# EAGLE design PiInTheSky-Mainboard-v2.3 (EAGLE 6.4)
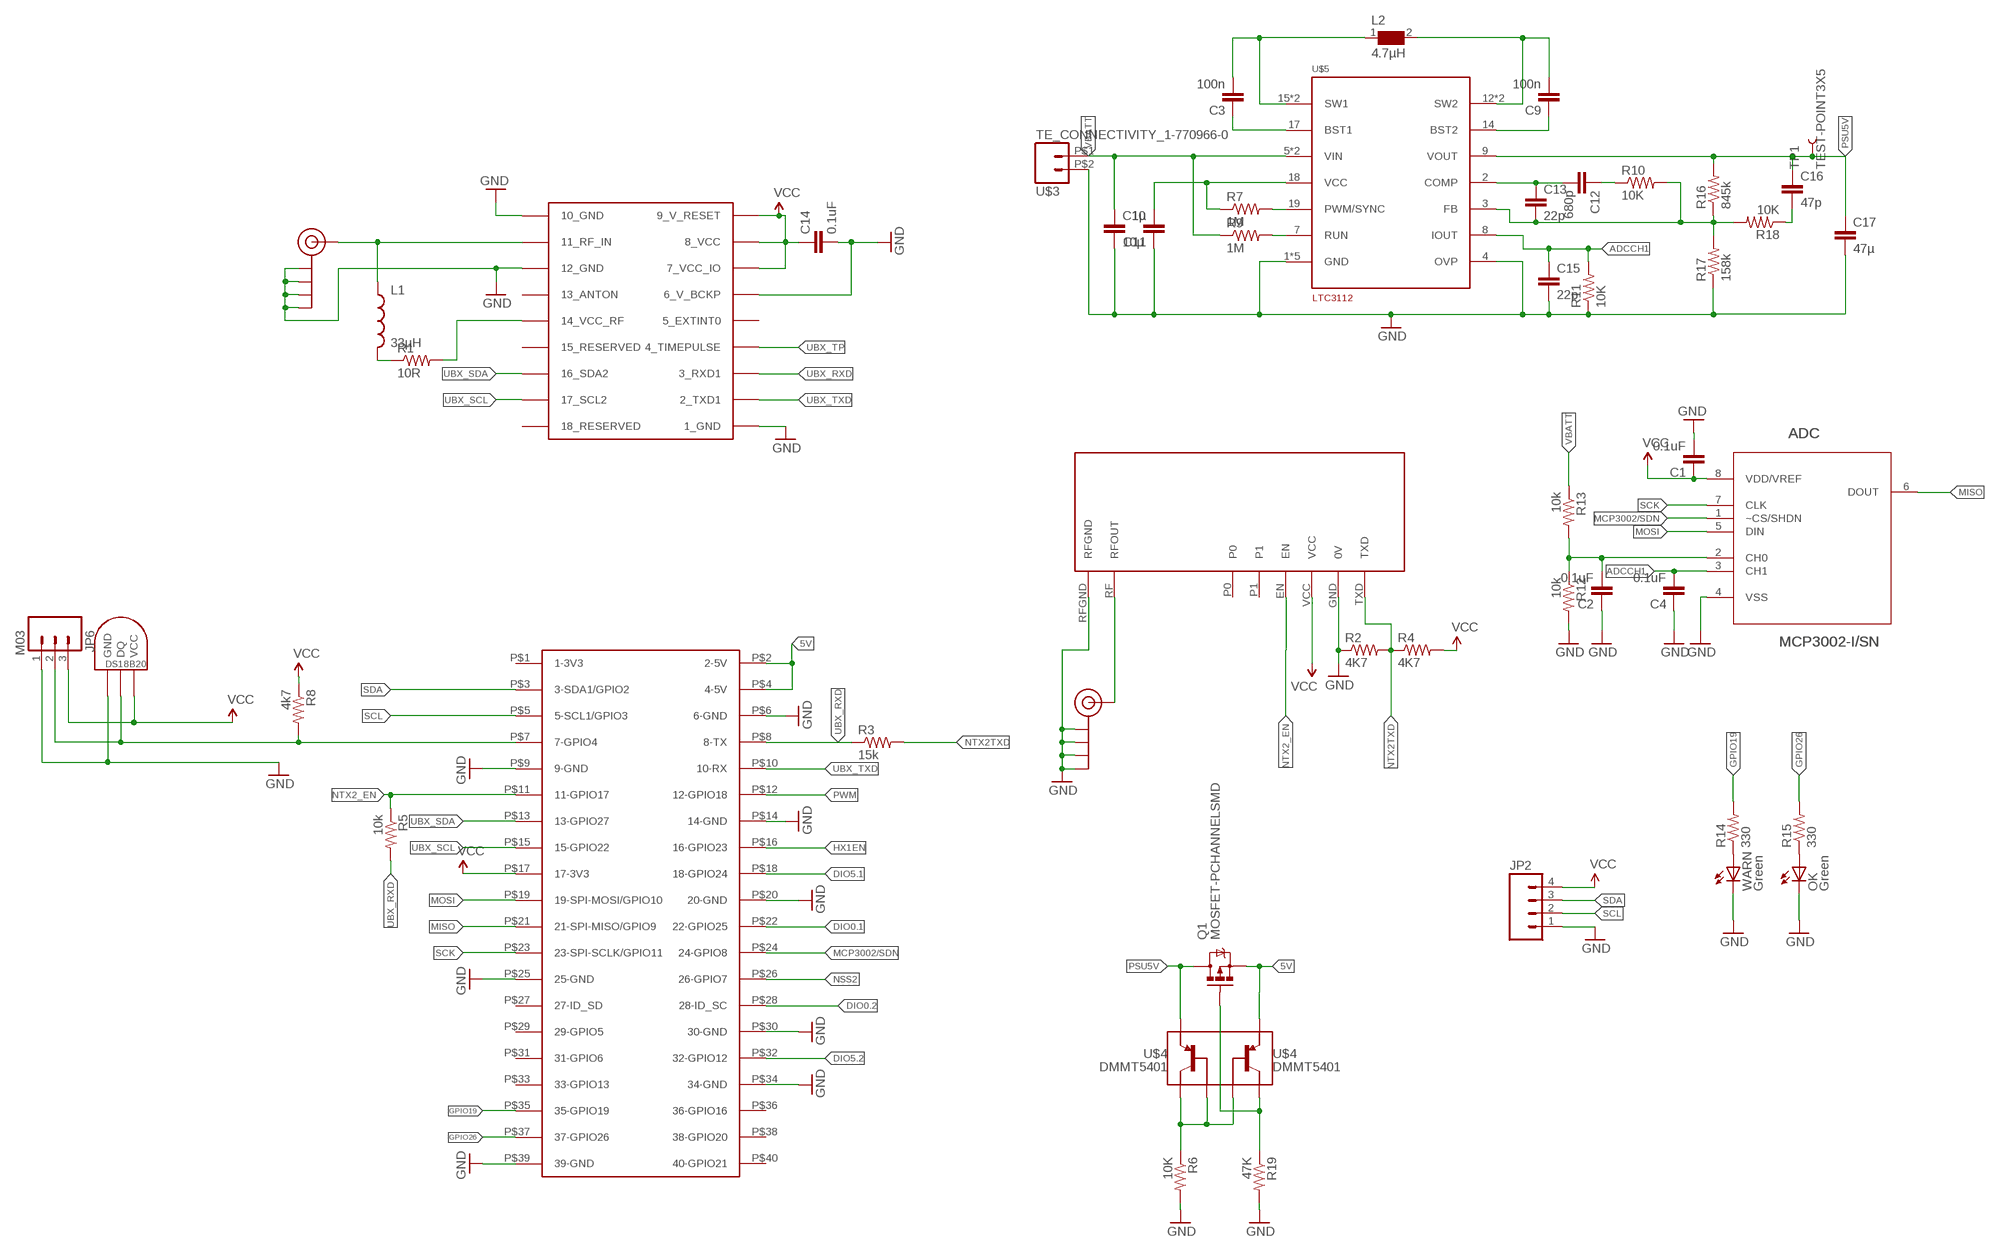
[diagram p0: schematic, sheet 1]

## Parts
ADC  MCP3002-I/SN  [SOIC127P600X175-8N]
C1  0.1uF  CAP0603-CAP  [0603-CAP]
C2  0.1uF  CAP0603-CAP  [0603-CAP]
C3  100n  CAP0603-CAP  [0603-CAP]
C4  0.1uF  CAP0603-CAP  [0603-CAP]
C9  100n  CAP0603-CAP  [0603-CAP]
C10  10µ  CAP1206  [1206]
C11  1µ  CAP0603-CAP  [0603-CAP]
C12  680p  CAP0603-CAP  [0603-CAP]
C13  22p  CAP0603-CAP  [0603-CAP]
C14  0.1uF  CAP0603-CAP  [0603-CAP]
C15  22p  CAP0603-CAP  [0603-CAP]
C16  47p  CAP0603-CAP  [0603-CAP]
C17  47µ  CAP1206  [1206]
J$1  SMA_EDGE  [SMA-EDGE]
J$2  SMA_EDGE  [SMA-EDGE]
JP2  M04PTH  [1X04]
JP6  M03  [M03-JST]
L1  33µH  INDUCTOR0603  [0603]
L2  4.7µH  WE-HCI-744311470_7030/7040/7050  [WE-HCI_7030/7040/7050]
OK  Green  LED0603  [LED-0603]
Q1  MOSFET-PCHANNELSMD  [SOT23-3]
R1  10R  RESISTOR0603-RES  [0603-RES]
R2  4K7  RESISTOR0603-RES  [0603-RES]
R3  15k  RESISTOR0603-RES  [0603-RES]
R4  4K7  RESISTOR0603-RES  [0603-RES]
R5  10k  RESISTOR0603-RES  [0603-RES]
R6  10K  RESISTOR0603-RES  [0603-RES]
R7  1M  RESISTOR0603-RES  [0603-RES]
R8  4k7  RESISTOR0603-RES  [0603-RES]
R9  1M  RESISTOR0603-RES  [0603-RES]
R10  10K  RESISTOR0603-RES  [0603-RES]
R11  10K  RESISTOR0603-RES  [0603-RES]
R12  10k  RESISTOR0603-RES  [0603-RES]
R13  10k  RESISTOR0603-RES  [0603-RES]
R14  330  RESISTOR0603-RES  [0603-RES]
R15  330  RESISTOR0603-RES  [0603-RES]
R16  845k  RESISTOR0603-RES  [0603-RES]
R17  158k  RESISTOR0603-RES  [0603-RES]
R18  10K  RESISTOR0603-RES  [0603-RES]
R19  47K  RESISTOR0603-RES  [0603-RES]
TEMP  DS1821  DS1820SOIC  [DS18B20_SOIC]
TP1  TEST-POINT3X5  [PAD.03X.05]
U$1  RASPBERRY-PI+  [RASPBERRY-PI-PLUS-CAM_NOTCH]
U$3  TE_CONNECTIVITY_1-770966-0  [TE_CONNECTIVITY_1-770966-0]
U$4  DMMT5401  [SOT26]
U$5  LTC3112  [TSSOP-20]
U$7  UBLOX_MAX  [UBLOX_MAX]
U$8  RADIOMETRIX-MTX2  [RADIOMETRIX-MTX2]
WARN  Green  LED0603  [LED-0603]

## Nets
5V: Q1.2(S) U$1.P$2(2-5V) U$1.P$4(4-5V) U$4.5(E2)
ADCCH1: ADC.3(CH1) C4.2 C15.1 R11.2 U$5.8(IOUT)
DIO0.1: U$1.P$22(22-GPIO25)
DIO0.2: U$1.P$28(28-ID_SC)
DIO5.1: U$1.P$18(18-GPIO24)
DIO5.2: U$1.P$32(32-GPIO12)
GND [vcc]: ADC.4(VSS) C1.2 C2.1 C4.1 C10.2 C11.1 C14.2 C15.2 C17.2 J$1.GND@0(GND) J$1.GND@1(GND) J$1.GND@2(GND) J$1.GND@3(GND) J$2.GND@0(GND) J$2.GND@1(GND) J$2.GND@2(GND) J$2.GND@3(GND) JP2.1 JP6.1 OK.C R2.1 R6.2 R11.1 R12.2 R17.1 R19.2 TEMP.GND U$1.P$6(6-GND) U$1.P$9(9-GND) U$1.P$14(14-GND) U$1.P$20(20-GND) U$1.P$25(25-GND) U$1.P$30(30-GND) U$1.P$34(34-GND) U$1.P$39(39-GND) U$3.P$2 U$5.1(GND) U$5.4(OVP) U$5.10(GND) U$5.11(GND) U$5.20(GND) U$5.21(GND) U$7.1_GND U$7.6_V_BCKP U$7.10_GND U$7.12_GND U$8.GND(0V) U$8.RFGND WARN.C
GPIO1: JP6.2 R8.2 TEMP.DQ U$1.P$7(7-GPIO4)
GPIO19: R14.2 U$1.P$35(35-GPIO19)
GPIO26: R15.2 U$1.P$37(37-GPIO26)
HX1EN: U$1.P$16(16-GPIO23)
MCP3002/SDN: ADC.1(~CS/SHDN) U$1.P$24(24-GPIO8)
MISO: ADC.6(DOUT) U$1.P$21(21-SPI-MISO/GPIO9)
MOSI: ADC.5(DIN) U$1.P$19(19-SPI-MOSI/GPIO10)
N$1: J$1.SIG(SIGNAL) L1.1 U$7.11_RF_IN
N$2: R1.2 U$7.14_VCC_RF
N$3: L1.2 R1.1
N$4: J$2.SIG(SIGNAL) U$8.RF(RFOUT)
N$5: C3.1 U$5.17(BST1)
N$6: ADC.2(CH0) C2.2 R12.1 R13.2
N$9: R6.1 U$4.1(C1) U$4.2(B1) U$4.3(B2)
N$10: C9.1 U$5.14(BST2)
N$11: C9.2 L2.2 U$5.12(SW2) U$5.13(SW2)
N$12: OK.A R15.1
N$13: C3.2 L2.1 U$5.15(SW1) U$5.16(SW1)
N$14: C11.2 R7.1 U$5.18(VCC)
N$16: R9.2 U$5.7(RUN)
N$17: R14.1 WARN.A
N$18: R7.2 U$5.19(PWM/SYNC)
N$19: C13.2 R10.2 R16.1 R17.2 R18.2 U$5.3(FB)
N$20: C12.2 C13.1 U$5.2(COMP)
N$21: C12.1 R10.1
N$22: C16.2 R18.1
N$24: Q1.1(G) R19.1 U$4.4(C2)
NSS2: U$1.P$26(26-GPIO7)
NTX2_EN: R5.1 U$1.P$11(11-GPIO17) U$8.EN
NTX2TXD: R2.2 R3.2 R4.1 U$8.TXD
PSU5V: C16.1 C17.1 Q1.3(D) R16.2 TP1.P$1 U$4.6(E1) U$5.9(VOUT)
PWM: U$1.P$12(12-GPIO18)
SCK: ADC.7(CLK) U$1.P$23(23-SPI-SCLK/GPIO11)
SCL: JP2.2 U$1.P$5(5-SCL1/GPIO3)
SDA: JP2.3 U$1.P$3(3-SDA1/GPIO2)
UBX_RXD: R3.1 R5.2 U$1.P$8(8-TX) U$7.3_RXD1
UBX_SCL: U$1.P$15(15-GPIO22) U$7.17_SCL2
UBX_SDA: U$1.P$13(13-GPIO27) U$7.16_SDA2
UBX_TP: U$7.4_TIMEPULSE
UBX_TXD: U$1.P$10(10-RX) U$7.2_TXD1
VBATT [vcc]: C10.1 R9.1 R13.1 U$3.P$1 U$5.5(VIN) U$5.6(VIN)
VCC: ADC.8(VDD/VREF) C1.1 C14.1 JP2.4 JP6.3 R4.2 R8.1 TEMP.VCC U$1.P$17(17-3V3) U$7.7_VCC_IO U$7.8_VCC U$7.9_V_RESET U$8.VCC
Unconnected: U$1.P$1(1-3V3) U$1.P$27(27-ID_SD) U$1.P$29(29-GPIO5) U$1.P$31(31-GPIO6) U$1.P$33(33-GPIO13) U$1.P$36(36-GPIO16) U$1.P$38(38-GPIO20) U$1.P$40(40-GPIO21) U$7.5_EXTINT0 U$7.13_ANTON U$7.15_RESERVED U$7.18_RESERVED U$8.P0 U$8.P1

## Library data of the parts
ADC = Ava:MCP3002-I/SN: Dual Channel 10-Bit A/D Converter; DESCRIPTION: Dual Channel 10-Bit A/D Converter; MPN: MCP3002-I/SN; OC_FARNELL: 1834969; OC_NEWARK: 59K0225; PACKAGE: SOIC-8; SUPPLIER: Microchip
C1-C4 C9-C17 = SparkFun:CAP: Capacitor Standard 0603 ceramic capacitor, and 0.1" leaded capacitor.
J$1 J$2 = SparkFun:SMA_EDGE: SMA Antenna Connector End launch SMA connector. The paste layer has been removed so that the connector can be hand soldered onto the board after reflow.
JP2 = SparkFun:M04: Header 4 Standard 4-pin 0.1" header. Use with straight break away headers (SKU : PRT-00116), right angle break away headers (PRT-00553), swiss pins (PRT-00743), machine pins (PRT-00117), and female headers (PRT-00115). Molex polarized connector foot print use with SKU : PRT-08231 with associated crimp pins and housings. 1MM SMD Version SKU: PRT-10208
JP6 = Ava:M03
L1 = SparkFun:INDUCTOR: Inductors Basic Inductor/Choke - 0603 and 1206. Footprints are not proven and vary greatly between part numbers.
L2 = WE-HCI:WE-HCI: SMD-Flat Wire High Current Inductor WE-HCI - Flat wire coil for lower losses at high frequency ranges - Low leakage field - Extremely low profile design - Current loading up to 40 A - Magnetically shielded -- Graphic cards -- Laptops -- Motherboards -- High current switching regulators -- Polyphase-switching regulators -- industrial computers; MPN: 744311470; OC_FARNELL: 1636195; OC_NEWARK: 08P2569; PACKAGE: 7040; SUPPLIER: Würth Elektronik eiSos GmbH
OK WARN = SparkFun:LED: LEDs Standard schematic elements and footprints for 5mm, 3mm, 1206, and 0603 sized LEDs. 5mm - Spark Fun Electronics SKU : COM-00529 (and others)
Q1 = SparkFun:MOSFET-PCHANNEL
R1-R19 = SparkFun:RESISTOR: Resistor Basic schematic elements and footprints for 0603, 1206, and PTH resistors.
TEMP = Ava:DS1820: DS18B20 Programmable Resolution 1-Wire Digital Thermometer Description The DS18B20 digital thermometer provides 9-bit to 12-bit Celsius temperature measurements and has an alarm function with nonvolatile user-programmable upper and lower trigger points. The DS18B20 communicates over a 1-Wire® bus that by definition requires only one data line (and ground) for communication with a central microprocessor. It has an operating temperature range of -55°C to +125°C and is accurate to ±0.5°C over the range of -10°C to +85°C. In addition, the DS18B20 can derive power directly from the data line ("parasite power"), eliminating the need for an external power supply. Each DS18B20 has a unique 64-bit serial code, which allows multiple DS18B20s to function on the same 1-Wire bus. Thus, it is simple to use one microprocessor to control many DS18B20s distributed over a large area. Applications that can benefit from this feature include HVAC environmental controls, temperature monitoring systems inside buildings, equipment, or machinery, and process monitoring and control systems.
TP1 = SparkFun:TEST-POINT
U$1 = Ava:RASPBERRY-PI+: Samtec SSW-120-01-T-D
U$3 = Ava:TE_CONNECTIVITY_1-770966-0; FARNELL: 1098556
U$4 = Ava:DMMT5401
U$5 = Ava:LTC3112
U$7 = Ava:UBLOX_MAX: UBLOX MAX
U$8 = Ava:RADIOMETRIX-MTX2

## Net classes
0 default: width 0.203 mm
1 vcc: width 0.254 mm

## Board
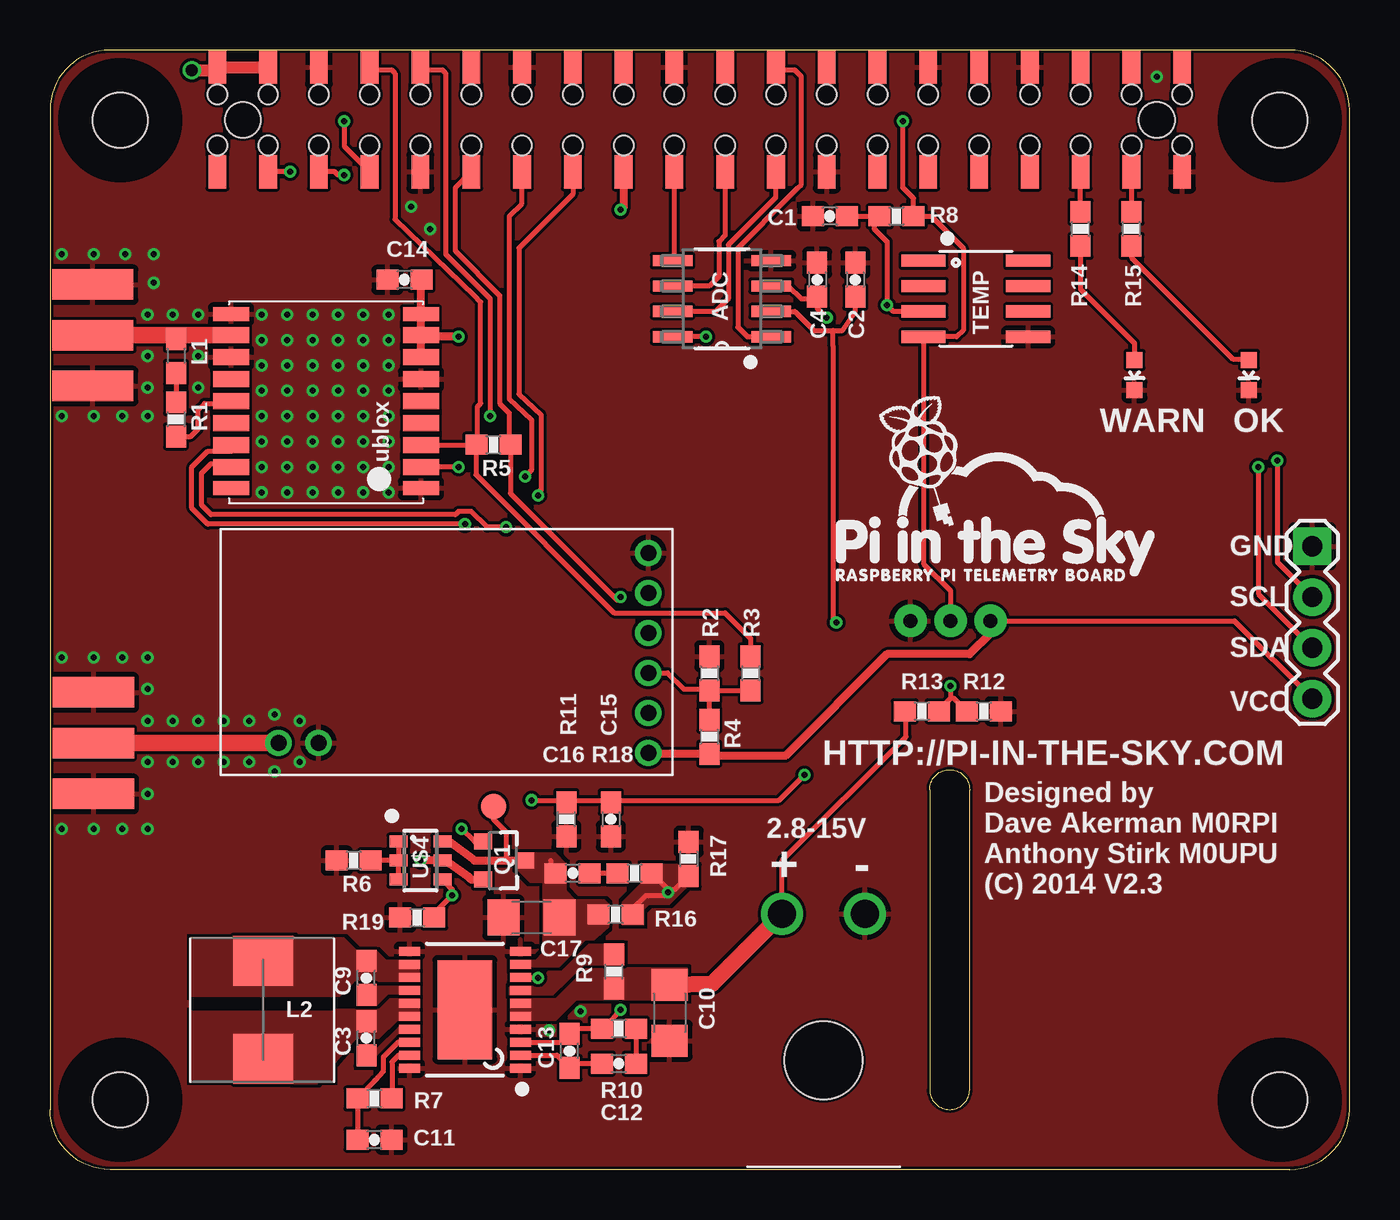
[diagram p1: board, top side]
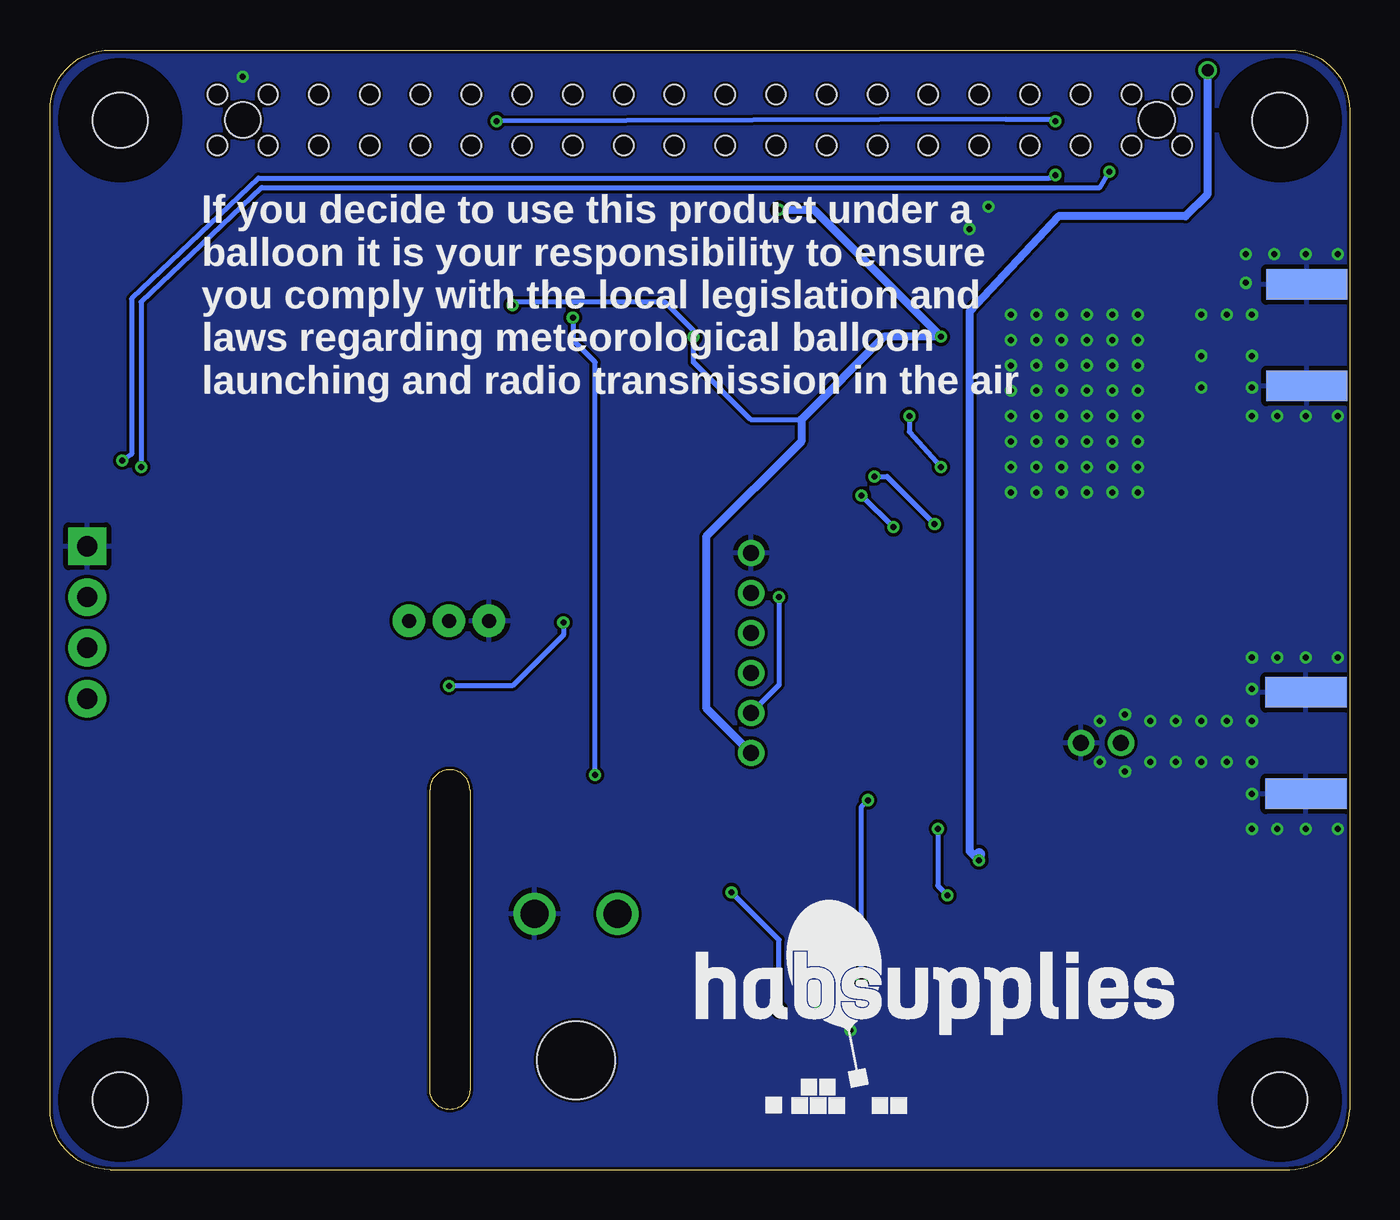
[diagram p2: board, bottom side, seen from below]

Size 65 x 56 mm. Coordinates in mm from the lower left corner, seen from the top.
Copper layers (1*16): Top 0.035mm / dielectric 1.5mm / Bottom 0.035mm
Design rules "Hackvana": minimum track width 0.15mm, minimum drill 0.3mm, track to track 6mil, track to pad 6mil, pad to pad 6mil, via to via 6mil, smd to smd 0mil, copper to edge 6mil, drill to drill 6mil, minimum pad ring 10mil, minimum via ring 6mil, stop-mask expansion 2mil, vias tented up to drill 100mil, thermal gap 10mil
tRestrict: area 7,8 to 14.2,8.6

### Footprints (pad centres in the part's own frame; a part is rotated, then mirrored left to right if it is on the bottom)
SOIC127P600X175-8N = smd 1.981 x 0.559: 1 -2.464,1.905; 2 -2.464,0.635; 3 -2.464,-0.635; 4 -2.464,-1.905; 5 2.464,-1.905; 6 2.464,-0.635; 7 2.464,0.635; 8 2.464,1.905
0603-CAP = smd 1.1 x 1: 1 -0.85,0; 2 0.85,0
1206 = smd 1.6 x 1.8: 1 -1.4,0; 2 1.4,0
SMA-EDGE = smd 1.524 x 4.064: GND@0 -2.54,0; GND@1 2.54,0; SIG 0,0 | smd 1.524 x 4.064 bottom: GND@2 -2.54,0; GND@3 2.54,0
1X04 = drill 1.016 pad 1.88 square: 1 0,0 | drill 1.016 pad 1.88: 2 2.54,0; 3 5.08,0; 4 7.62,0
M03-JST = drill 0.7 pad 1.626: 1 -2,0.08; 2 0,0.08; 3 2,0.08
0603 = smd 1.1 x 1: 1 -0.85,0; 2 0.85,0
WE-HCI_7030/7040/7050 = smd 2.5 x 3: 1 -2.45,0; 2 2.45,0
LED-0603 = smd 0.8 x 0.8: A 0,-0.75; C 0,0.75
SOT23-3 = smd 0.8 x 0.9: 1 -0.95,-1; 2 0.95,-1; 3 0,1.1
0603-RES = smd 1.1 x 1: 1 -0.85,0; 2 0.85,0
DS18B20_SOIC = smd 0.61 x 2.21: DQ 1.905,-2.616; GND 1.905,2.616; NC -1.905,-2.616; NC2 -0.635,-2.616; NC3 -1.905,2.616; NC4 -0.635,2.616; NC5 0.635,2.616; VCC 0.635,-2.616
PAD.03X.05 = smd 1.27 x 1.27: P$1 0,0
RASPBERRY-PI-PLUS-CAM_NOTCH = smd 0.889 x 1.68: P$1 -34.13,21.905; P$2 -34.13,27.145; P$3 -31.59,21.905; P$4 -31.59,27.145; P$5 -29.05,21.905; P$6 -29.05,27.145; P$7 -26.51,21.905; P$8 -26.51,27.145; P$9 -23.97,21.905; P$10 -23.97,27.145; P$11 -21.43,21.905; P$12 -21.43,27.145; P$13 -18.89,21.905; P$14 -18.89,27.145; P$15 -16.35,21.905; P$16 -16.35,27.145; P$17 -13.81,21.905; P$18 -13.81,27.145; P$19 -11.27,21.905; P$20 -11.27,27.145; P$21 -8.73,21.905; P$22 -8.73,27.145; P$23 -6.19,21.905; P$24 -6.19,27.145; P$25 -3.65,21.905; P$26 -3.65,27.145; P$27 -1.11,21.905; P$28 -1.11,27.145; P$29 1.43,21.905; P$30 1.43,27.145; P$31 3.97,21.905; P$32 3.97,27.145; P$33 6.51,21.905; P$34 6.51,27.145; P$35 9.05,21.905; P$36 9.05,27.145; P$37 11.59,21.905; P$38 11.59,27.145; P$39 14.13,21.905; P$40 14.13,27.145 | hole 2.75: -39,24.5; 19,24.5; -39,-24.5; 19,-24.5 | hole 1.78: -32.86,24.5; 12.86,24.5 | hole 0.97: -34.13,25.77; -31.59,25.77; -29.05,25.77; -26.51,25.77; -23.97,25.77; -21.43,25.77; -18.89,25.77; -16.35,25.77; -13.81,25.77; -11.27,25.77; -8.73,25.77; -6.19,25.77; -3.65,25.77; -1.11,25.77; 1.43,25.77; 3.97,25.77; 6.51,25.77; 9.05,25.77; 11.59,25.77; 14.13,25.77; -34.13,23.23; -31.59,23.23; -29.05,23.23; -26.51,23.23; -23.97,23.23; -21.43,23.23; -18.89,23.23; -16.35,23.23; -13.81,23.23; -11.27,23.23; -8.73,23.23; -6.19,23.23; -3.65,23.23; -1.11,23.23; 1.43,23.23; 3.97,23.23; 6.51,23.23; 9.05,23.23; 11.59,23.23; 14.13,23.23
TE_CONNECTIVITY_1-770966-0 = drill 1.4: P$1 -2.07,7.34; P$2 2.07,7.34 | hole 3.9: 0,0
SOT26 = smd 0.6 x 0.9: 1 -0.95,-1.1; 2 0,-1.1; 3 0.95,-1.1; 4 0.95,1.1; 5 0,1.1; 6 -0.95,1.1
TSSOP-20 = smd 0.45 x 1.05: 1 -2.925,-2.775; 2 -2.275,-2.775; 3 -1.625,-2.775; 4 -0.975,-2.775; 5 -0.325,-2.775; 6 0.325,-2.775; 7 0.975,-2.775; 8 1.625,-2.775; 9 2.275,-2.775; 10 2.925,-2.775; 11 2.925,2.775; 12 2.275,2.775; 13 1.625,2.775; 14 0.975,2.775; 15 0.325,2.775; 16 -0.325,2.775; 17 -0.975,2.775; 18 -1.625,2.775; 19 -2.275,2.775; 20 -2.925,2.775 | smd 4.95 x 2.74: 21 0,0
UBLOX_MAX = smd 1.8 x 0.7: 1_GND 4.95,-4.4; 9_V_RESET 4.95,4.3; 10_GND -4.55,4.3; 18_RESERVED -4.55,-4.4 | smd 1.8 x 0.8: 2_TXD1 4.95,-3.35; 3_RXD1 4.95,-2.25; 4_TIMEPULSE 4.95,-1.15; 5_EXTINT0 4.95,-0.05; 6_V_BCKP 4.95,1.05; 7_VCC_IO 4.95,2.15; 8_VCC 4.95,3.25; 11_RF_IN -4.55,3.25; 12_GND -4.55,2.15; 13_ANTON -4.55,1.05; 14_VCC_RF -4.55,-0.05; 15_RESERVED -4.55,-1.15; 16_SDA2 -4.55,-2.25; 17_SCL2 -4.55,-3.35
RADIOMETRIX-MTX2 = drill 0.8: EN 9.97,-3.25; GND 9.97,4.75; P0 9.97,2.75; P1 9.97,0.75; RF -8.53,-4.75; RFGND -6.53,-4.75; TXD 9.97,-1.25; VCC 9.97,-5.25

### Placement (x,y rotation side)
ADC  33.61,43.56 180 top
C1  39.01,47.69 180 top
C2  40.28,44.51 270 top
C3  15.83,6.57 90 top
C4  38.37,44.51 270 top
C9  15.83,9.59 90 top
C10  30.99,7.84 270 top
C11  16.23,1.49 180 top
C12  28.45,5.3 180 top
C13  25.99,5.93 90 top
C14  17.73,44.51 180 top
C15  28.05,17.52 270 top
C16  26.15,14.82 0 top
C17  24.09,12.6 180 top
J$1  2.14,41.73 90 top
J$2  2.18,21.33 90 top
JP2  63.14,31.18 270 top
JP6  45.04,27.36 0 top
L1  6.3,40.7 270 top
L2  10.67,8 90 top
OK  59.96,39.75 180 top
Q1  22.66,15.46 270 top
R1  6.3,37.52 270 top
R2  32.98,24.82 270 top
R3  35.04,24.82 270 top
R4  32.98,21.65 270 top
R5  22.18,36.26 180 top
R6  15.2,15.46 180 top
R7  16.23,3.55 0 top
R8  42.34,47.69 0 top
R9  28.21,9.9 90 top
R10  28.45,7.04 180 top
R11  25.83,17.52 90 top
R12  46.71,22.92 0 top
R13  43.61,22.92 0 top
R14  51.55,47.05 90 top
R15  54.09,47.05 90 top
R16  28.29,12.76 180 top
R17  31.94,15.54 270 top
R18  29.24,14.82 0 top
R19  18.37,12.6 180 top
TEMP  46.31,43.56 270 top
TP1  22.18,18.16 0 top
U$1  42.5,28 0 top
U$2  [PITS_LOGO_SMALL]  39.33,29.43 0 top
U$3  38.69,5.46 0 top
U$4  18.53,15.46 270 top
U$5  20.75,8 90 top
U$7  13.61,38.48 0 top
U$8  19.96,26.09 0 top
U$9  [NEW-HS-LOGO-MED]  32.78,2.8 0 bottom
WARN  54.25,39.75 180 top

### Tracks (layer width: path | path; a pad name or v marks a point on that pad's centre or on a via)
5V  (via drill 0.3, 0.6)
  Top 0.406: v18.53,15.46 U$4.5 19.8,15.46 20.91,14.66 21.07,14.51 Q1.2
  Top 0.61: U$1.P$4 U$1.P$2 8.21,54.99 v7.1,54.99
  Bottom 0.406: v7.1,54.99 7.1,48.8 8.21,47.69 14.56,47.69 19,42.92 19,26.41 19,15.93 v18.53,15.46
  Bottom 0.61: v18.53,15.46 18.53,15.78
ADCCH1  (via drill 0.3)
  Top 0.254: ADC.3 36.94,44.19 37.58,43.56 38.27,43.56 C4.2 38.37,43.08 v38.85,42.61 | U$5.8 24.36,9.62 v24.4,9.59 | v24.09,18.48 25.62,18.48 R11.2 25.83,18.63 25.99,18.48 27.84,18.48 | 27.84,18.48 C15.1 | 27.84,18.48 36.47,18.48 v37.74,19.74
  Bottom 0.254: v38.85,42.61 38.85,41.49 38.69,41.34 37.74,40.38 v37.74,19.74 | v24.4,9.59 24.4,18.16 v24.09,18.48
GND  (via drill 0.3)
  other vias: 4.88,22.44 6.15,22.44 7.42,22.44 8.69,22.44 9.96,22.44 11.23,22.76 12.5,22.44 4.88,20.38 6.15,20.38 7.42,20.38 8.69,20.38 9.96,20.38 11.23,19.9 12.5,20.38 4.88,42.76 16.94,42.76 16.94,41.49 16.94,40.22 16.94,38.95 16.94,37.68 16.94,36.41 16.94,35.14 16.94,33.87 11.86,42.76 11.86,41.49 11.86,40.22 11.86,38.95 11.86,37.68 11.86,36.41 11.86,35.14 11.86,33.87 13.13,42.76 13.13,41.49 13.13,40.22 13.13,38.95 13.13,37.68 13.13,36.41 13.13,35.14 13.13,33.87 14.4,42.76 14.4,41.49 14.4,40.22 14.4,38.95 14.4,37.68 14.4,36.41 14.4,35.14 14.4,33.87 15.67,42.76 15.67,41.49 15.67,40.22 15.67,38.95 15.67,37.68 15.67,36.41 15.67,35.14 15.67,33.87 10.59,42.76 10.59,41.49 10.59,40.22 10.59,38.95 10.59,37.68 10.59,36.41 10.59,35.14 10.59,33.87 7.42,42.76 6.15,42.76 7.42,40.7 7.42,39.11 4.88,40.7 4.88,39.11 4.88,37.68 5.19,44.35 5.19,45.78 3.77,45.78 2.18,45.78 0.59,45.78 0.59,37.68 2.18,37.68 3.61,37.68 4.88,25.62 0.59,25.62 2.18,25.62 3.61,25.62 4.88,24.03 4.88,18.79 4.88,17.05 0.59,17.05 2.18,17.05 3.61,17.05 24.96,6.97 26.55,7.92 18.05,48.16 19,47.05 55.36,54.67
  pour Top (rank 2): -0.05,55.94 65.36,55.94 65.36,0.06 -0.05,0.06
  pour Bottom (rank 2): -0.05,55.94 65.36,55.94 65.36,0.06 -0.05,0.06
GPIO1  (via drill 0.3)
  Top 0.254: v42.66,52.45 42.66,49.11 43.19,48.58 R8.2 44.09,47.69 45.67,46.1 45.67,41.97 45.36,41.65 TEMP.DQ 43.69,30.3 45.04,28.95 JP6.2 | v14.72,52.45 14.72,51.18 U$1.P$7
  Bottom 0.254: v42.66,52.45 42.5,52.45 17.18,52.53 14.8,52.53 v14.72,52.45
GPIO19
  Top 0.254: R14.2 U$1.P$35
GPIO26
  Top 0.254: U$1.P$37 R15.2
MCP3002/SDN
  Top 0.254: ADC.1 34.88,41.65 34.4,42.13 34.4,46.1 36.94,48.64 37.42,49.11 37.58,49.27 37.58,54.67 37.26,54.99 36.31,54.99 U$1.P$24
MISO
  Top 0.254: ADC.6 32.98,44.19 33.45,44.67 33.45,46.41 33.77,46.73 U$1.P$21
MOSI
  Top 0.254: ADC.5 31.23,45.55 U$1.P$19
N$1
  Top 0.406: J$1.SIG 2.49,41.73
  Top 0.813: 2.49,41.73 U$7.11_RF_IN 6.3,41.73 L1.1 6.3,41.65
N$2
  Top 0.254: R1.2 7.04,36.67 7.42,37.05 7.42,38 7.73,38.32 8.95,38.32 U$7.14_VCC_RF
N$3
  Top 0.254: L1.2 R1.1
N$4
  Top 0.813: U$8.RF 2.19,21.34 arc90 J$2.SIG
N$5
  pour Top (no thermals): 18.49,7.24 17.46,7.24 17.46,7.16 16.35,6.05 15.35,6.05 15.35,5.14 16.35,5.14 16.35,5.7 17.46,6.81 18.49,6.81
N$6  (via drill 0.3)
  Top 0.254: ADC.2 37.26,42.92 38.21,41.97 39.17,41.97 | 39.17,41.97 39.64,41.97 40.28,42.92 C2.2 | 39.17,41.97 39.17,41.18 39.17,27.52 v39.33,27.36 | v45.04,24.19 45.04,23.58 | 45.04,23.58 45.04,23.55 44.46,22.98 R13.2 | 45.04,23.58 45.2,23.58 R12.1
  Bottom 0.254: v39.33,27.36 39.33,26.73 41.87,24.19 v45.04,24.19
N$9
  Top 0.254: U$4.2 R6.1 | U$4.1 U$4.2 | U$4.3 U$4.2
N$10
  pour Top (no thermals): 15.39,9.19 18.49,9.19 18.49,8.75 16.9,8.75 16.35,8.2 15.35,8.2
N$11
  pour Top (no thermals): 18.49,10.5 16.82,10.5 16.35,10.97 12.89,10.97 12.18,11.69 10.67,11.69 9.56,10.58 10.83,10.58 12.18,9.23 14.64,9.23 15.23,9.39 18.45,9.39 18.49,9.43
  pour Top (no thermals): 7.02,11.61 14.72,11.61 15.35,10.97 15.35,9.51 14.48,8.63 7.02,8.63
N$12
  Top 0.254: R15.1 54.09,45.62 59.17,40.54 59.92,40.54 OK.A
N$13
  pour Top (no thermals): 18.49,8.55 16.98,8.55 16.46,8.04 13.41,8.04 12.18,6.81 10.19,6.81 9.84,6.45 10,6.45 12.18,4.27 13.37,4.27 15.31,6.53 16.46,6.53 17.38,7.44 18.49,7.44
  pour Top (no thermals): 14.2,8.04 13.29,8.04 13.21,7.96 7.02,7.96 7.02,4.39 14.2,4.39
N$14
  Top 0.254: U$5.18 17.42,6.37 16.66,5.62 16.66,4.9 16.27,4.46 16.25,4.46 R7.1 C11.2
N$16
  pour Top (no thermals): 28.73,11.29 28.73,10.22 26.7,10.22 25.16,8.71 22.97,8.71 22.97,9.15 23.01,9.19 24.16,9.19 24.2,9.15 24.6,9.15 24.84,9.39 24.84,9.86 24.92,9.94 25.59,9.94 26.94,11.29
N$17
  Top 0.254: R14.1 51.55,44.03 54.25,41.34 WARN.A
N$18
  Top 0.254: U$5.19 17.44,5.72 17.1,5.38 17.1,3.89 R7.2
N$19  (via drill 0.3)
  Top 0.254: U$5.3 25.58,6.37 C13.2 26.25,7.04 R10.2 27.74,7.04 v28.53,8 | 30.91,14.01 v30.91,13.87 30.75,13.71 29.8,13.71 29.14,13.05 R16.1 | 30.91,14.01 R18.2 | 30.91,14.01 31.26,14.01 R17.2
  Bottom 0.254: v28.53,8 28.53,11.49 v30.91,13.87
  pour Top (no thermals): 28.61,12.2 28.61,13.39 29.56,14.35 29.56,15.3 31.39,15.3 31.47,15.22 32.42,15.22 32.42,14.11 31.86,14.11 30.99,13.24 29.96,13.24 29.72,13 29.72,12.2
N$20
  Top 0.254: U$5.2 25.35,5.72 C13.1 26.2,5.3 C12.2
N$21
  Top 0.254: R10.1 C12.1
N$22
  Top 0.254: R18.1 C16.2
N$24  (via drill 0.3)
  Top 0.254: Q1.1 21.23,16.41 v20.59,17.05 | U$4.4 20.12,14.02 v20.12,13.71 19.22,12.82 R19.1
  Bottom 0.254: v20.59,17.05 20.59,14.19 v20.12,13.71
NTX2_EN  (via drill 0.3)
  Top 0.254: v28.53,28.63 28.37,28.48 23.03,33.82 R5.1 22.97,36.31 22.97,37.84 22.5,38.32 22.5,43.72 20.27,45.94 20.27,49.11 U$1.P$11 21.07,50.38
  Bottom 0.254: v28.53,28.63 28.53,24.24 U$8.EN
NTX2TXD
  Top 0.254: U$8.TXD 30.89,24.84 31.7,24.03 32.92,24.03 R2.2 | R4.1 R2.2 | R2.2 R3.2
PSU5V
  Top 0.254: 25.04,15.46 25.04,15.08 C16.1 | TP1.P$1 22.18,17.52 22.82,16.89 22.82,15.46
  Top 0.406: U$4.6 19.96,16.41 21.23,15.46 22.82,15.46 Q1.3
  pour Top (no thermals): 27.97,13.28 27.97,12.12 27.22,11.45 26.78,11.45 25.47,10.1 23.01,10.1 23.01,10.5 24.28,10.5 24.64,10.86 24.64,15.3 24.68,15.34 25.83,15.34 25.83,13.95 26.27,13.51 27.74,13.51
  pour Top (no thermals): 23.29,15.86 25.28,15.86 25.83,15.3 25.83,14.35 24.01,14.35 23.29,15.06
SCK
  Top 0.254: ADC.7 33.29,42.92 33.93,43.56 33.93,46.26 36.31,48.64 U$1.P$23
SCL  (via drill 0.3)
  Top 0.254: v61.39,35.46 61.39,30.38 JP2.2 | v14.72,49.75 14.4,49.75 14.24,49.91 U$1.P$5
  Bottom 0.254: v61.39,35.46 60.91,35.78 60.91,43.56 54.56,49.59 15.04,49.59 v14.72,49.75
SDA  (via drill 0.3)
  Top 0.254: v60.44,35.14 60.44,28.79 JP2.3 | v12.02,49.91 U$1.P$3
  Bottom 0.254: v60.44,35.14 60.44,43.4 54.41,49.11 12.5,49.11 v12.02,49.91
UBX_RXD
  Top 0.254: U$7.3_RXD1 21.3,36.23 | 21.3,36.23 R5.2 21.39,36.31 21.39,38.16 21.55,38.32 21.55,43.4 21.23,43.72 17.26,47.53 17.26,54.83 17.1,54.99 16.15,54.99 U$1.P$8 | 21.3,36.23 21.3,34.75 28.21,27.84 33.77,27.84 35.04,26.57 R3.1
UBX_SCL  (via drill 0.3)
  Top 0.254: v24.4,33.72 24.56,34.03 24.56,37.76 23.45,38.8 23.45,46.1 26.15,48.8 U$1.P$15 | v22.82,32.13 21.86,32.13 21.07,32.92 20.43,32.92 20.27,32.76 8.05,32.76 7.58,33.24 7.58,34.83 8.05,35.3 9.04,35.3 U$7.17_SCL2
  Bottom 0.254: v24.4,33.72 v22.82,32.13
UBX_SDA  (via drill 0.3)
  Top 0.254: v23.77,34.67 24.09,34.98 24.09,37.52 22.97,38.56 22.97,47.69 23.61,48.32 U$1.P$13 | v20.75,32.29 7.89,32.29 7.1,33.08 7.1,35.14 7.89,35.94 9.09,35.94 U$7.16_SDA2
  Bottom 0.254: v23.77,34.67 23.13,34.67 v20.75,32.29
UBX_TXD  (via drill 0.3)
  Top 0.254: v22.02,37.68 22.02,43.56 19.8,45.78 19.8,54.83 19.64,54.99 18.69,54.99 U$1.P$10 | v20.43,35.14 18.57,35.14 U$7.2_TXD1
  Bottom 0.254: v22.02,37.68 22.02,36.89 v20.43,35.14
VBATT
  Top 0.254: U$3.P$1 36.62,15.45 42.82,21.65 42.82,22.86 R13.1
  Top 0.813: C10.1 33.12,9.3 U$3.P$1
  pour Top (no thermals): 23.01,7.44 25.32,7.44 26.35,8.47 31.9,8.47 31.9,10.06 31.86,10.1 28.85,10.1 28.81,10.06 26.78,10.06 25.28,8.55 23.01,8.55
VCC  (via drill 0.3)
  Top 0.254: 29.97,20.8 U$8.VCC | v32.82,41.65 ADC.8 | JP6.3 59.25,27.45 JP2.4 | TEMP.VCC 42.18,42.92 v41.87,43.24 41.87,46.41 41.23,47.05 41.23,47.42 R8.1 C1.1
  Top 0.406: 29.97,20.8 R4.2 33.08,20.7 36.78,20.7 41.87,25.78 45.99,25.78 47.04,26.82 JP6.3 | C14.1 18.56,44.48 U$7.9_V_RESET U$7.8_VCC | U$7.7_VCC_IO U$7.8_VCC | v20.43,41.65 18.63,41.65 U$7.8_VCC | U$1.P$17 28.69,48.16 v28.53,48
  Bottom 0.254: 27.42,37.52 29.96,37.52 32.82,40.38 v32.82,41.65 32.82,41.97 34.24,43.4 41.71,43.4 v41.87,43.24
  Bottom 0.406: U$8.VCC 32.18,23.1 32.18,31.65 27.42,36.41 27.42,37.52 23.29,41.65 v20.43,41.65 26.78,48 v28.53,48

### Text on the board
tPlace: ADC | WARN | OK | GND | SCL | SDA | VCC | HTTP://PI-IN-THE-SKY.COM | 2.8-15V | + | - | Designed by / Dave Akerman M0RPI / Anthony Stirk M0UPU / (C) 2014 V2.3
bPlace: If you decide to use this product under a / balloon it is your responsibility to ensure / you comply with the local legislation and / laws regarding meteorological balloon / launching and radio transmission in the air